# Altium schematic sheet CC-S10-V00-PSU-5V.SchDoc: Power Supply (9-25V to 5V @ 0.1-0.3A)
size A3; DrawnBy: Jonn Dillon; DocumentNumber: 11; Revision: 01; SheetNumber: 11; SheetTotal: 13; Version: 01; Project: Chassis Controller (Interim) 2020; PageSetup: Record=PageOptions|CenterHorizontal=True|CenterVertical=True|PrintScale=0.97|XCorrection=1.00|YCorrection=1.00|PrintKind=0|BorderSize=5000000|LeftOffset=0|BottomOffset=0|Orientation=2|PaperLength=1000|PaperWidth=1000|Scale=100|PaperSource=7|PrintQuality=-4|MediaType=1|DitherType=10|PaperKind=A4|PrintScaleMode=1
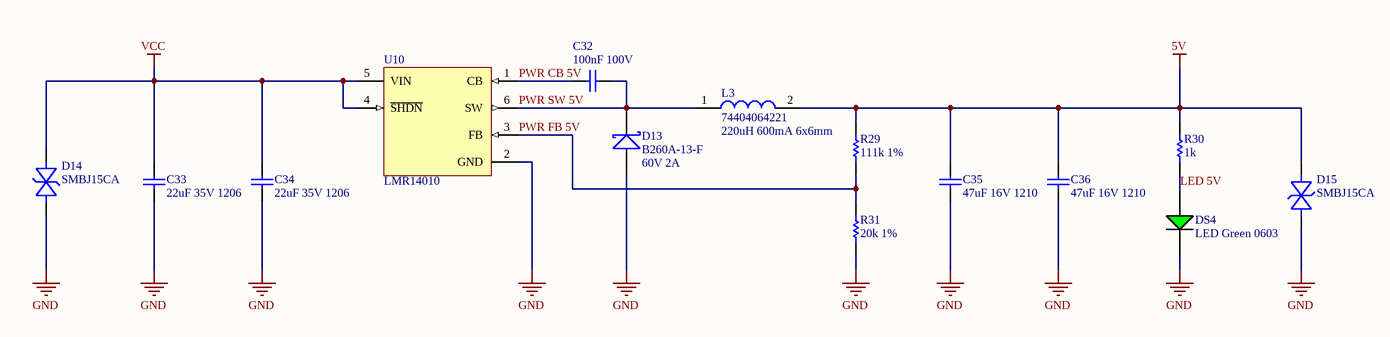
[diagram p0: CC-S10-V00-PSU-5V.SchDoc]

## Parts
C32  100nF 100V  [Cap_Ceramic_0603]
C33  22uF 35V 1206  [Cap_Ceramic_1206]
C34  22uF 35V 1206  [Cap_Ceramic_1206]
C35  47uF 16V 1210  [Cap_Ceramic_1210]
C36  47uF 16V 1210  [Cap_Ceramic_1210]
D13  B260A-13-F  [SMA]
D14  SMBJ15CA  [SMB]
D15  SMBJ15CA  [SMB]
DS4  LED Green 0603  [LED GREEN 0603]
L3  74404064221  [Inductor_6x6mm]
R29  111k 1%  [Res_ThinFilm_0603]
R30  1k  [Res_ThinFilm_0603]
R31  20k 1%  [Res_ThinFilm_0603]
U10  LMR14010  [LMR14010]

## Nets
5V: C35.2 C36.2 D15.K(Cathode) L3.2 R29.2 R30.2
GND: C33.1 C34.1 C35.1 C36.1 D13.A D14.A(Anode) D15.A(Anode) DS4.2(C) R31.1 U10.2(GND)
VCC: C33.2 C34.2 D14.K(Cathode) U10.4(~{SHDN}) U10.5(VIN)
LED 5V: DS4.1(A) R30.1
PWR CB 5V: C32.1 U10.1(CB)
PWR FB 5V: R29.1 R31.2 U10.3(FB)
PWR SW 5V: C32.2 D13.K L3.1 U10.6(SW)

## Notes on the sheet
- (near L3) 220uH 600mA 6x6mm
- (near D13) 60V 2A
- Revision History:
- Sheet Title:
- Rev
- Date
- Description
- Project:
- Size:
- Drawn By:
- A3
- Number:
- Revision:
- Sheet
- Version:
- of
- QUT Motorsport
- O-120, Gardens Point
- 2 George Street
- Brisbane, QLD 4000
- Australia
- Print Date:
- Print Time:
- File Name:

## Library data of the parts
C32 = 100nF 100V 5% X7R 0603: Capacitor, Ceramic, SMD, 100nF, 100V, 5%, X7R, 0603
C33 C34 = 22uF 35V 10% X7R 1206: Capacitor, Ceramic, SMD, 22uF, 35V, 10%, X7R, 1206
C35 C36 = 47uF 16V 10% X7R 1210: Capacitor, Ceramic, SMD, 47uF, 16V, 5%, X7R, 1210
D13 = B260A-13-F: Diode, Schottky Barrier Rectifier, 60 V, 2 A, B260A-13-F
D14 D15 = SMBJ15CA: Diode, SMD, TVS Diode, 15V 24.4V, DO214AA/SMB; ComponentLink1Description: Digikey; ComponentLink1URL: https://www.digikey.com.au/product-detail/en/littelfuse-inc/SMBJ15CA/SMBJ15CALFCT-ND/285983; ComponentLink2Description: Datasheet; ComponentLink2URL: https://www.littelfuse.com/~/media/electronics/datasheets/tvs_diodes/littelfuse_tvs_diode_smbj_datasheet.pdf.pdf
L3 = 74404064221: FIXED IND 220UH 660MA 850 MOHM; ComponentLink1Description: Digikey; ComponentLink1URL: https://www.digikey.com.au/product-detail/en/w%C3%BCrth-elektronik/74404064221/732-7261-1-ND/5353241; ComponentLink2Description: LCSC A; ComponentLink2URL: https://lcsc.com/product-detail/Power-Inductors_Sunlord-SWPA6045S221MT_C91047.html; ComponentLink3Description: LCSC B; ComponentLink3URL: https://lcsc.com/product-detail/Power-Inductors_SXN-Shun-Xiang-Nuo-Elec-SMNR6045-221MT_C467145.html
R29 = 111k 1% 0603: Resistor, SMD, 111k, 0.1W, 5%, 0603
R30 = 1k 5% 0603: Resistor, SMD, 1k, 0.1W, 5%, 0603
R31 = 20k 1% 0603: Resistor, SMD, 20k, 0.1W, 1%, 0603